# EasyEDA Pro project MAR.eprj

# Schematic Schematic1
Board Name: Board1; Create Date: 2025-08-24; Page Name: P1; Project Name: MAR; Schematic Name: Schematic1; Update Date: 2025-08-26; Company: EasyEDA.com; Page Size: A4; Version: V1.0
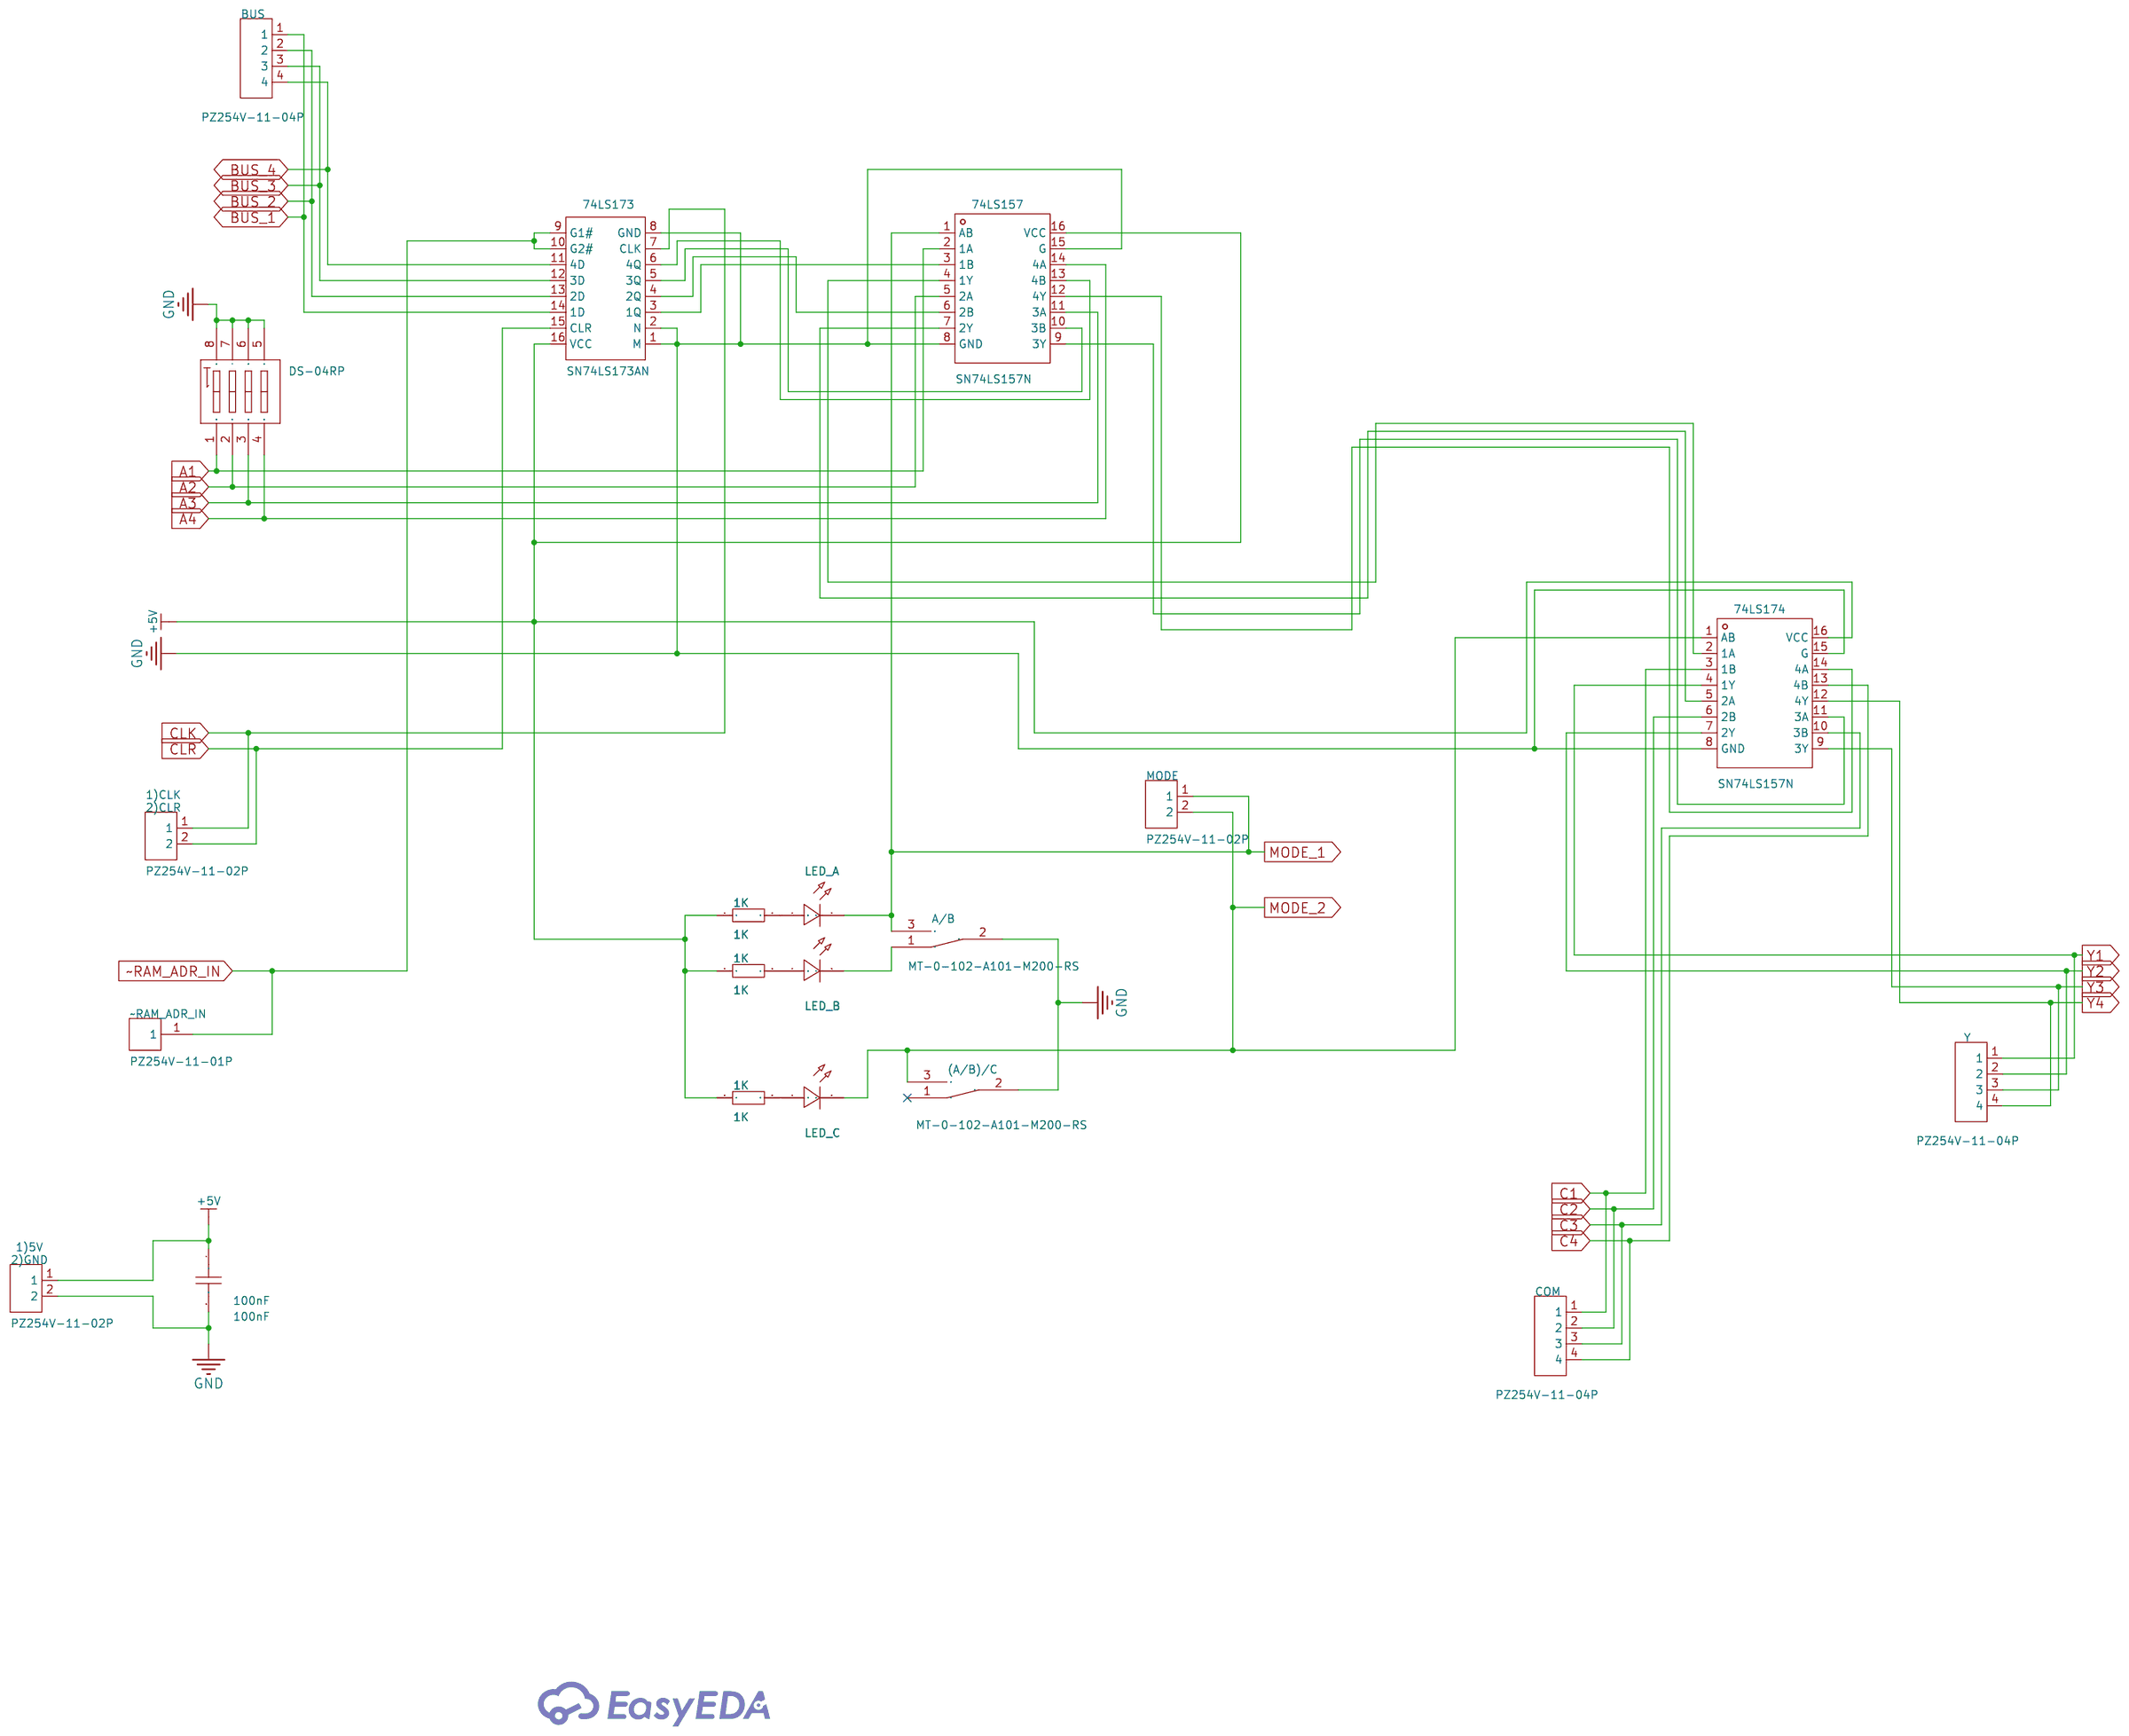
[diagram p0: schematic sheet]

## Parts
1)5V
2)GND  PZ254V-11-02P  [HDR-TH_2P-P2.54-V-M]
1)CLK
2)CLR  PZ254V-11-02P  [HDR-TH_2P-P2.54-V-M]
1K  1K  [R_AXIAL-0.4]
1K#2  1K  [R_AXIAL-0.4]
1K#3  1K  [R_AXIAL-0.4]
74LS157  SN74LS157N  [DIP-16_16P-L20.2-W6.6-P2.54-LS7.6-BL]
74LS173  SN74LS173AN  [PDIP-16_L19.3-W6.4-P2.54-LS7.94-BL]
74LS174  SN74LS157N  [DIP-16_16P-L20.2-W6.6-P2.54-LS7.6-BL]
100nF  100nF  [CAP-TH_L8.5-W5.0-P5.00-D1.2]
(A/B)/C  MT-0-102-A101-M200-RS  [SW-TH_MT-0-103-A101-M200-RS]
A/B  MT-0-102-A101-M200-RS  [SW-TH_MT-0-103-A101-M200-RS]
BUS  PZ254V-11-04P  [HDR-TH_4P-P2.54-V-M]
COM  PZ254V-11-04P  [HDR-TH_4P-P2.54-V-M]
DIP  DS-04RP  [SW-TH_DS-04XP]
LED_A  -  [LED-TH_BD5.8-P2.54-FD]
LED_B  -  [LED-TH_BD5.8-P2.54-FD]
LED_C  -  [LED-TH_BD5.8-P2.54-FD]
MODE  PZ254V-11-02P  [HDR-TH_2P-P2.54-V-M]
Y  PZ254V-11-04P  [HDR-TH_4P-P2.54-V-M]
~RAM_ADR_IN  PZ254V-11-01P  [HDR-TH_1P-P2.54-V-M]

## Library data of the parts
1)5V
2)GND 1)CLK
2)CLR MODE = PZ254V-11-02P: LCSC Part Name: 1x2P 间距:2.54mm 方针 直插; Supplier Part: C492401; Manufacturer: XFCN(兴飞); Supplier Footprint: 插件,P=2.54mm; JLCPCB Part Class: Extended Part; Datasheet: https://item.szlcsc.com/datasheet/PZ254V-11-02P/502957.html; Supplier: LCSC; Pin Structure: 1x2P; Pitch: 2.54mm; Circluar Pins/Square Pins: Pin Header; Mounting Type: Through Hole; Number of Rows: 1; Number of Pins: 2P; Length of Mating Pin: 6mm; Insulation Height: 2.5mm; Length of End Connection Pin: 3mm; Contact Material: Brass; Operating Temperature: -40℃~+105℃; Color: Black
1K 1K#2 1K#3 = Res_AXIAL-1/4W: Supplier Footprint: Through
74LS157 74LS174 = SN74LS157N: Type:Multiplexers Voltage Supply Source:Single supply Supply Voltage:4.75V~5.25V Supply Voltage:4.75V~5.25V Sink Current:8mA Source Current:400uA Operating temperature:0℃~+70℃ Operating temperature:0℃~+70℃; Supplier Part: C139317; Manufacturer: TI(德州仪器); Supplier Footprint: DIP-16; JLCPCB Part Class: Extended Part; Datasheet: https://www.ti.com/cn/lit/gpn/sn74ls157; Supplier: LCSC; Type: Multiplexers; Voltage Supply Source: Single supply; Supply Voltage: 4.75V~5.25V; Sink Current: 8mA; Source Current: 400uA; Operating temperature: 0℃~+70℃
74LS173 = SN74LS173AN: Type:D-Type Trigger Type:Rising Edge Voltage - Supply:4.75V~5.25V Voltage - Supply:4.75V~5.25V Clock Frequency:50MHz Function:Reset Number of Elements:1 Number of Bits per Element:4 Output Type:- Propagation Delay:30ns@5V,45pF Series:74LS Series Current -; Supplier Part: C1550125; Manufacturer: TI(德州仪器); Supplier Footprint: PDIP-16; JLCPCB Part Class: Extended Part; Datasheet: https://www.ti.com/cn/lit/gpn/sn74ls173a; Supplier: LCSC; Type: D-Type; Trigger Type: Rising Edge; Voltage - Supply: 4.75V~5.25V; Clock Frequency: 50MHz; Function: Reset; Number of Elements: 1; Number of Bits per Element: 4; Propagation Delay: 30ns@5V,45pF; Series: 74LS Series; Current - Output Low(IOL): 24mA; Current - Output High(IOH): 2.6mA; Quiescent Current: 24mA; Operating Temperature: 0℃~+70℃
100nF = CT4-0805B104K500F3: Capacitance:100nF Tolerance:±10% Tolerance:±10% Voltage Rated: Temperature Coefficient:; LCSC Part Name: 100nF ±10% 50V C3型（直脚）; Supplier Part: C84772; Manufacturer: FH(风华); Supplier Footprint: 插件,P=5.08mm; JLCPCB Part Class: Extended Part; Datasheet: https://atta.szlcsc.com/upload/public/pdf/source/20190402/C385200_059806A6312B28FF1421A2413EB641E1.pdf; Supplier: LCSC; Tolerance: ±10%
(A/B)/C A/B = MT-0-102-A101-M200-RS: Circuit:Single Pole Double Throw (SPDT) Switch Length:13mm Switch Width:8mm Switch Height:28.6mm Mechanical Life:- Contact Current:5A Voltage Rating (AC):125V Actuator Type:Cylinder knob Pin Style:Solder Mounting Style:Direct Insert Operating Temperature:; LCSC Part Name: 小型钮子三脚二档 五件套; Supplier Part: C1788492; Manufacturer: YUEN FUNG(源丰); Supplier Footprint: 插件; JLCPCB Part Class: Extended Part; Datasheet: https://atta.szlcsc.com/upload/public/pdf/source/20230720/8E5C36EFDF374AE4FF4AC09DB233CE0E.pdf; Supplier: LCSC; Circuit: Single Pole Double Throw (SPDT); Switch Length: 13mm; Switch Width: 8mm; Switch Height: 28.6mm; Contact Current: 5A; Voltage Rating (AC): 125V; Actuator Type: Cylinder knob; Pin Style: Solder; Mounting Style: Direct Insert; Operating Temperature: -25℃~+85℃
BUS COM Y = PZ254V-11-04P_C492403: LCSC Part Name: 1x4P 间距:2.54mm 方针 直插; Supplier Part: C492403; Manufacturer: XFCN(兴飞); Supplier Footprint: 插件,P=2.54mm; JLCPCB Part Class: Extended Part; Datasheet: https://atta.szlcsc.com/upload/public/pdf/source/20200309/C492403_F9F19131791D08044AD4F84F8E751A34.pdf; Supplier: LCSC; Pin Structure: 1x4P; Pitch: 2.54mm; Circluar Pins/Square Pins: Policy; Mounting Type: Straight; Number of Rows: Single Row; Number of Pins: 4P; Length of Mating Pin: 6mm; Insulation Height: 2.5mm; Length of End Connection Pin: 3mm; Contact Material: Brass; Operating Temperature: -40℃~+105℃; Color: Black
DIP = DS-04RP_C92645: LCSC Part Name: 间距2.54mm 平拨,凸起式 4位拨码开关; Supplier Part: C92645; Manufacturer: 韩国韩荣; Supplier Footprint: 插件; JLCPCB Part Class: Extended Part; Datasheet: https://atta.szlcsc.com/upload/public/pdf/source/20210810/ECF2F28B1CE673E7F9581E27682BDB10.pdf; Supplier: LCSC; Type: 平拨,凸起式; Circuit: SPST; Number of Positions: 4Bit; Lead Pitch: 2.54mm; Current Rating: 25mA; Voltage Rating: 24V; Operating Temperature: -20℃~+70℃; Operating Life: 3千次; Color: Red
LED_A LED_B LED_C = LED_TH-R_5mm: Supplier Footprint: Through
~RAM_ADR_IN = PZ254V-11-01P: LCSC Part Name: 1x1P 间距:2.54mm 方针 直插; Supplier Part: C492400; Manufacturer: XFCN(兴飞); Supplier Footprint: 插件,P=2.54mm; JLCPCB Part Class: Extended Part; Datasheet: https://item.szlcsc.com/datasheet/PZ254V-11-01P/502956.html; Supplier: LCSC; Pin Structure: 1x1P; Pitch: 2.54mm; Circluar Pins/Square Pins: Pin Header; Mounting Type: Through Hole; Number of Rows: 1; Number of Pins: 1P; Length of Mating Pin: 6mm; Insulation Height: 2.5mm; Length of End Connection Pin: 3mm; Contact Material: Brass; Operating Temperature: -40℃~+105℃; Color: Black

## Nets
+5V: 1)5V
2)GND.1 1K.1 1K#2.1 1K#3.1 74LS157.16(VCC) 74LS173.16(VCC) 74LS174.16(VCC) 100nF.1
GND: 1)5V
2)GND.2 74LS157.8(GND) 74LS157.15(G) 74LS173.1(M) 74LS173.2(N) 74LS173.8(GND) 74LS174.8(GND) 74LS174.15(G) 100nF.2 (A/B)/C.2 A/B.2 DIP.5 DIP.6 DIP.7 DIP.8
A1: 74LS157.2(1A) DIP.1(A1)
A2: 74LS157.5(2A) DIP.2(A2)
A3: 74LS157.11(3A) DIP.3(A3)
A4: 74LS157.14(4A) DIP.4(A4)
BUS_1: 74LS173.14(1D) BUS.1
BUS_2: 74LS173.13(2D) BUS.2
BUS_3: 74LS173.12(3D) BUS.3
BUS_4: 74LS173.11(4D) BUS.4
C1: 74LS174.3(1B) COM.1
C2: 74LS174.6(2B) COM.2
C3: 74LS174.10(3B) COM.3
C4: 74LS174.13(4B) COM.4
CLK: 1)CLK
2)CLR.1 74LS173.7(CLK)
CLR: 1)CLK
2)CLR.2 74LS173.15(CLR)
MODE_1: 74LS157.1(AB) A/B.3 LED_A.2(A) MODE.1
MODE_2: 74LS174.1(AB) (A/B)/C.3 LED_C.2(A) MODE.2
Y1: 74LS174.4(1Y) Y.1
Y2: 74LS174.7(2Y) Y.2
Y3: 74LS174.9(3Y) Y.3
Y4: 74LS174.12(4Y) Y.4
~RAM_ADR_IN: 74LS173.9(G1#) 74LS173.10(G2#) ~RAM_ADR_IN.1
$1N1780: 74LS157.10(3B) 74LS173.5(3Q)
$1N1781: 74LS157.6(2B) 74LS173.4(2Q)
$1N1782: 74LS157.3(1B) 74LS173.3(1Q)
$1N1783: 74LS157.13(4B) 74LS173.6(4Q)
$1N1788: 74LS157.4(1Y) 74LS174.2(1A)
$1N1796: 74LS157.7(2Y) 74LS174.5(2A)
$1N1804: 74LS157.9(3Y) 74LS174.11(3A)
$1N1814: 74LS157.12(4Y) 74LS174.14(4A)
$1N1887: A/B.1 LED_B.2(A)
Net-(1K#2-2): 1K#2.2 LED_B.1(C)
Net-(1K#3-2): 1K#3.2 LED_C.1(C)
Net-(1K-2): 1K.2 LED_A.1(C)

Not connected (* = marked no-connect by the designer): (A/B)/C 1*

# Board PCB1
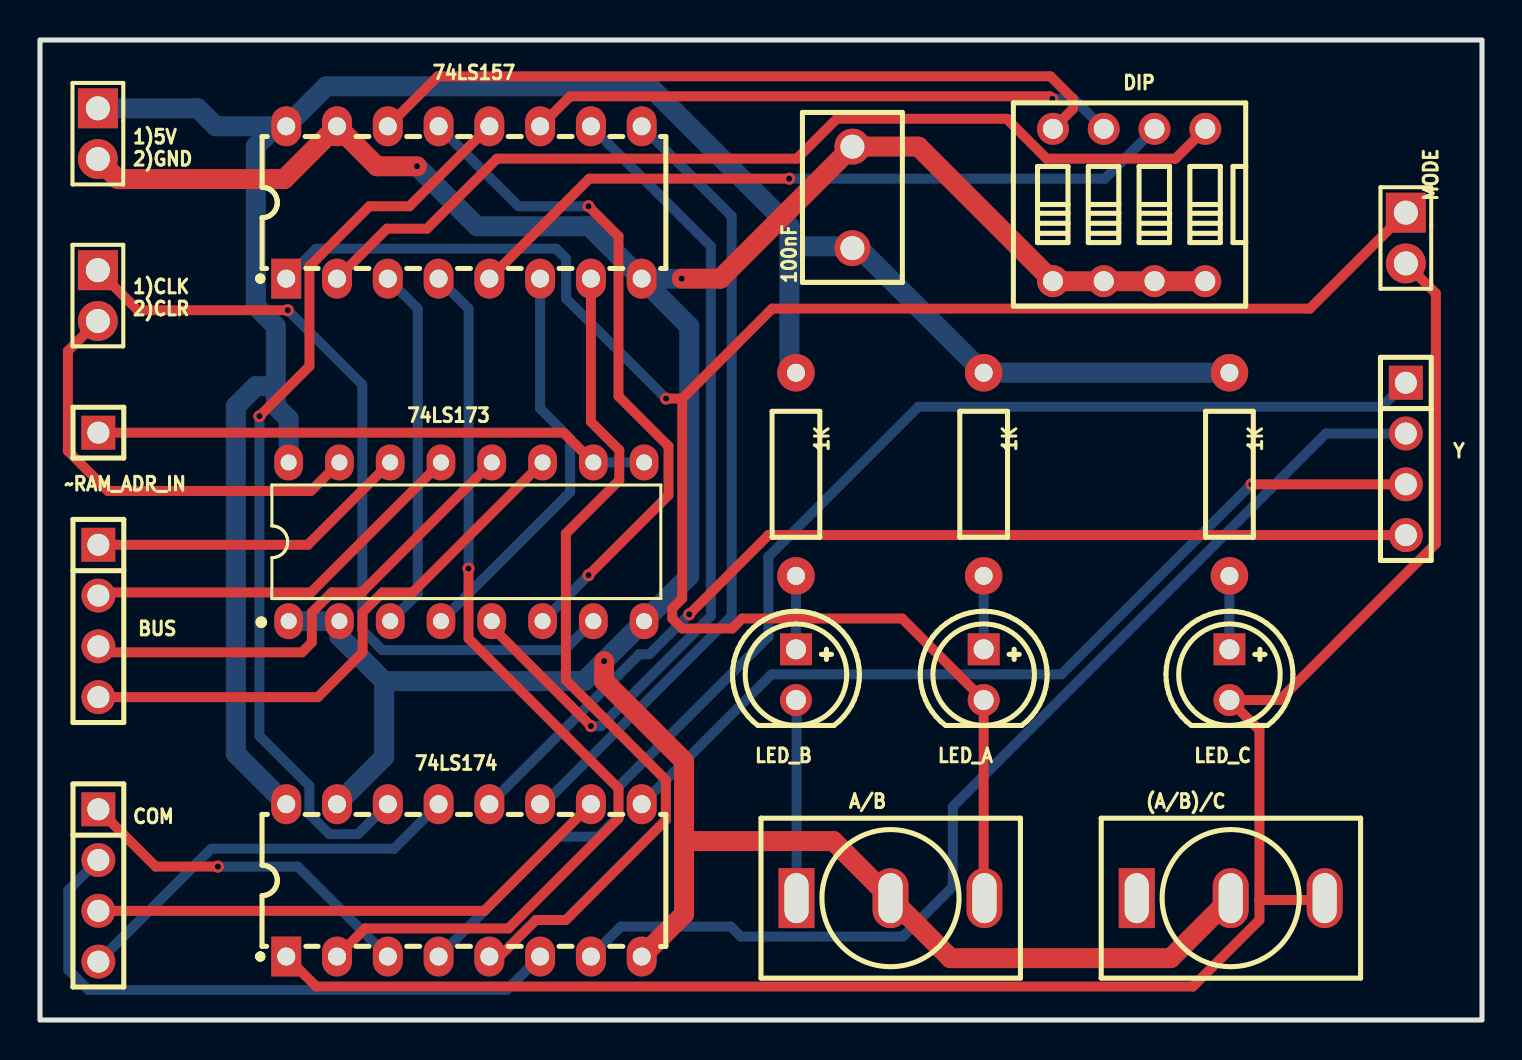
[diagram p1: board, top side]
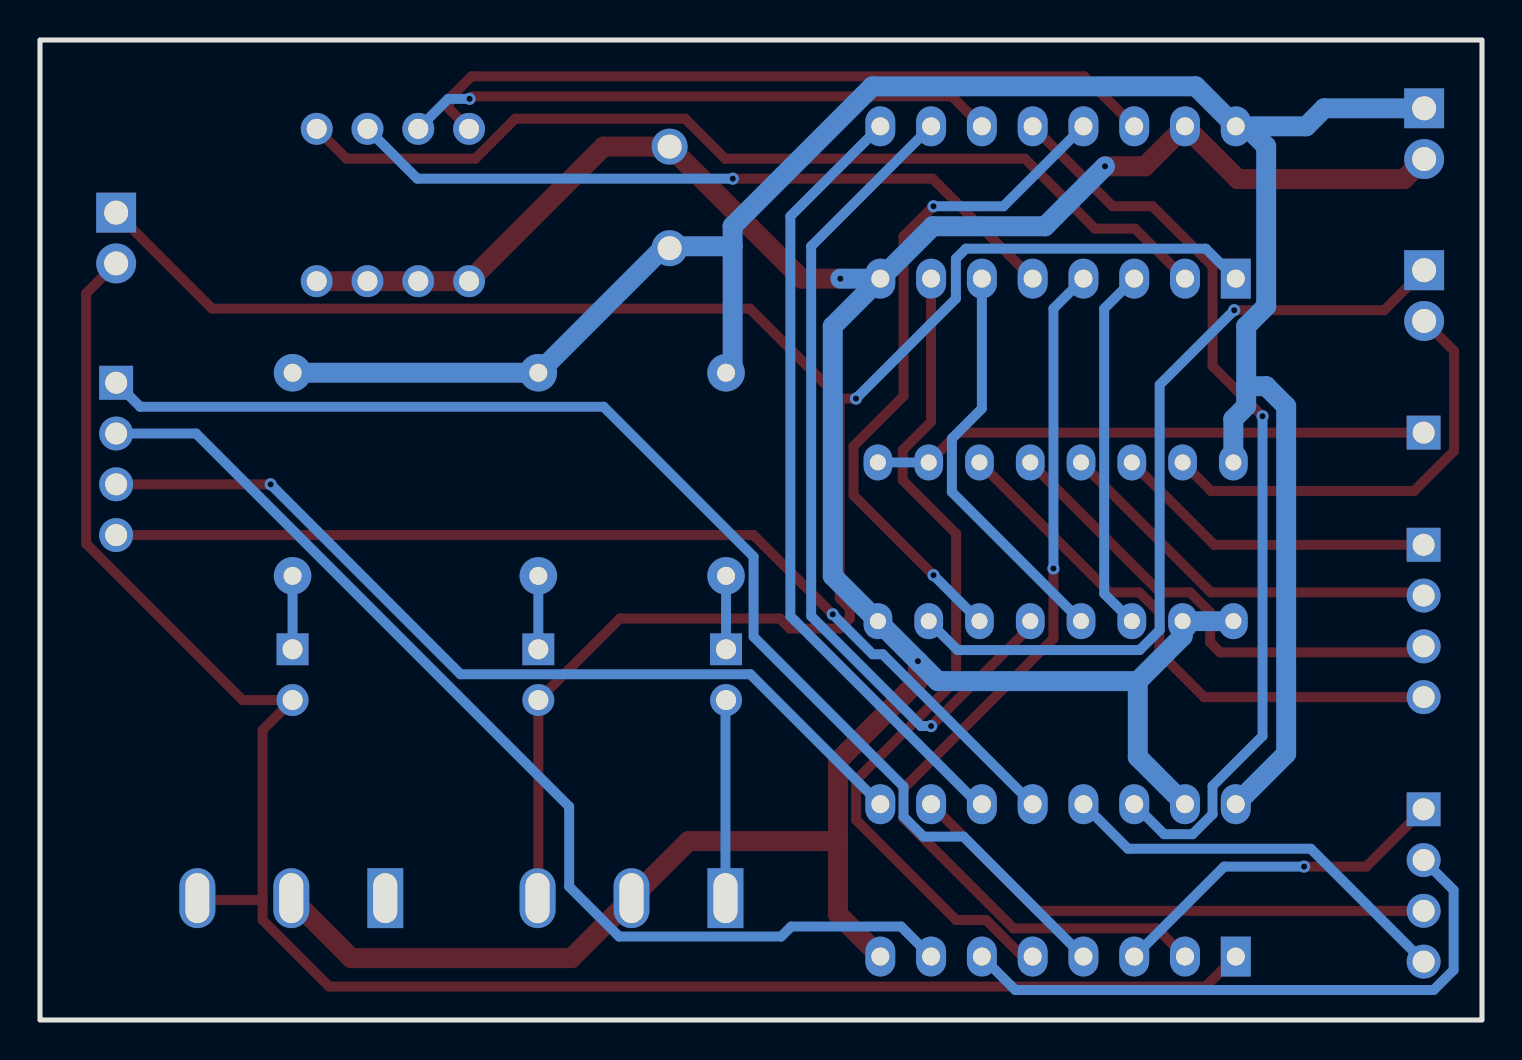
[diagram p2: board, bottom side, seen from below]

Outline 72.14 x 49.02 mm; copper layers: Top Layer, Bottom Layer. Coordinates in mm from the lower left corner of the outline.
Outline path: rectangle 0,49.02 72.14,0
Stack: Top Layer 0.035mm / Dielectric1 1.51mm FR4 er 4.5 / Bottom Layer 0.035mm

## Design rules (mm)
template: Custom Config
spacing copperThickness1oz (default): track to track 0.102, other pairs 0.152 to 0.3
spacing copperThickness2oz: track to track 0.203, other pairs 0.152 to 0.3
track width copperThickness1oz (default): min 0.127, default 0.5, max 2.54
track width copperThickness2oz: min 0.203, default 1, max 2.54
differential pair differentialPair (default): width min 0.127, default 0.254, max 2.54; gap min 0.152, default 0.152
via viaSize (default): diameter min 0.5, default 0.61, max 10; hole min 0.3, default 0.305, max 6.3
net +5V uses copperThickness2oz
net GND uses copperThickness2oz

## Placement (name value [footprint] x y rotation side)
1)5V
2)GND  PZ254V-11-02P  [HDR-TH_2P-P2.54-V-M]  2.9 44.34 270 top
1)CLK
2)CLR  PZ254V-11-02P  [HDR-TH_2P-P2.54-V-M]  2.9 36.24 270 top
1K  1K  [R_AXIAL-0.4]  47.21 27.3 270 top
1K#2  1K  [R_AXIAL-0.4]  37.82 27.3 270 top
1K#3  1K  [R_AXIAL-0.4]  59.5 27.3 270 top
74LS157  SN74LS157N  [DIP-16_16P-L20.2-W6.6-P2.54-LS7.6-BL]  21.21 40.89 0 top
74LS173  SN74LS173AN  [PDIP-16_L19.3-W6.4-P2.54-LS7.94-BL]  21.33 23.92 0 top
74LS174  SN74LS157N  [DIP-16_16P-L20.2-W6.6-P2.54-LS7.6-BL]  21.21 6.98 0 top
100nF  100nF  [CAP-TH_L8.5-W5.0-P5.00-D1.2]  40.64 41.15 90 top
(A/B)/C  MT-0-102-A101-M200-RS  [SW-TH_MT-0-103-A101-M200-RS]  59.56 6.1 0 top
A/B  MT-0-102-A101-M200-RS  [SW-TH_MT-0-103-A101-M200-RS]  42.54 6.1 0 top
BUS  PZ254V-11-04P  [HDR-TH_4P-P2.54-V-M]  2.92 19.96 270 top
COM  PZ254V-11-04P  [HDR-TH_4P-P2.54-V-M]  2.92 6.73 270 top
DIP  DS-04RP  [SW-TH_DS-04XP]  54.48 40.77 180 top
LED_A  -  [LED-TH_BD5.8-P2.54-FD]  47.21 17.27 270 top
LED_B  -  [LED-TH_BD5.8-P2.54-FD]  37.82 17.27 270 top
LED_C  -  [LED-TH_BD5.8-P2.54-FD]  59.5 17.27 270 top
MODE  PZ254V-11-02P  [HDR-TH_2P-P2.54-V-M]  68.33 39.12 270 top
Y  PZ254V-11-04P  [HDR-TH_4P-P2.54-V-M]  68.33 28.07 270 top
~RAM_ADR_IN  PZ254V-11-01P  [HDR-TH_1P-P2.54-V-M]  2.92 29.38 0 top

## Footprints (pads in the part's own frame, mm; a bottom-side part is the same pattern mirrored in y, then rotated)
CAP-TH_L8.5-W5.0-P5.00-D1.2
  round 1.8 hole 1.2: 1(-2.54,0) 2(2.54,0)
DIP-16_16P-L20.2-W6.6-P2.54-LS7.6-BL
  rect 1.5x2 hole 0.9: 1(-8.89,-3.81)
  oval 1.5x2 hole 0.9: 2(-6.35,-3.81) 3(-3.81,-3.81) 4(-1.27,-3.81) 5(1.27,-3.81) 6(3.81,-3.81) 7(6.35,-3.81) 8(8.89,-3.81) 9(8.89,3.81) 10(6.35,3.81) 11(3.81,3.81) 12(1.27,3.81) 13(-1.27,3.81) 14(-3.81,3.81) 15(-6.35,3.81) 16(-8.89,3.81)
HDR-TH_1P-P2.54-V-M
  rect 1.7x1.7 hole 1.1: 1(0,0)
HDR-TH_2P-P2.54-V-M
  rect 2x2 hole 1.2: 1(-1.27,0)
  round 2 hole 1.2: 2(1.27,0)
HDR-TH_4P-P2.54-V-M
  rect 1.7x1.7 hole 1.1: 1(-3.81,0)
  round 1.7 hole 1.1: 2(-1.27,0) 3(1.27,0) 4(3.81,0)
LED-TH_BD5.8-P2.54-FD
  rect 1.6x1.6 hole 1: 1(-1.27,0)
  round 1.6 hole 1: 2(1.27,0)
PDIP-16_L19.3-W6.4-P2.54-LS7.94-BL
  oval 1.44x1.8 hole 0.8: 1(-8.89,-3.97) 2(-6.35,-3.97) 3(-3.81,-3.97) 4(-1.27,-3.97) 5(1.27,-3.97) 6(3.81,-3.97) 7(6.35,-3.97) 8(8.89,-3.97) 9(8.89,3.97) 10(6.35,3.97) 11(3.81,3.97) 12(1.27,3.97) 13(-1.27,3.97) 14(-3.81,3.97) 15(-6.35,3.97) 16(-8.89,3.97)
R_AXIAL-0.4
  round 1.879 hole 0.899: 1(-5.08,0) 2(5.08,0)
SW-TH_DS-04XP
  round 1.6 hole 1: 1(-3.81,-3.81) 2(-1.27,-3.81) 3(1.27,-3.81) 4(3.81,-3.81) 5(3.81,3.81) 6(1.27,3.81) 7(-1.27,3.81) 8(-3.81,3.81)
SW-TH_MT-0-103-A101-M200-RS
  rect 1.8x3 hole 1.2x2.5: 1(-4.7,0)
  oval 1.8x3 hole 1.2x2.5: 2(0,0) 3(4.7,0)

## Nets
As in the schematic, except:
$1N1875: 1K.2 LED_A.1
$1N1876: 1K#2.2 LED_B.1
$1N1885: 1K#3.2 LED_C.1

Pads without a net: (A/B)/C 1

## Via types
v1: diameter 0.61, hole 0.305, Top Layer to Bottom Layer, 15 vias

## Routing (per net, layer and track width the routed paths; a pad name or vN(x,y) marks a point on that pad's centre or on a via; arc(x,y) is an arc through that point)
+5V: length 112.1
  Bottom Layer w1: 11.8,44.7 8.8,44.7 7.9,45.61 1)5V
2)GND.1 ; 11.8,44.7 74LS157.16 14.32,46.7 30.49,46.7 37.49,39.7 37.49,38.7 ; 11.8,44.7 10.8,43.7 10.8,35.7 11.8,34.7 11.8,31.7 ; 37.49,38.7 40.54,38.7 100nF.1 40.97,38.61 1K.1 1K#3.1 ; 37.49,38.7 37.49,32.7 1K#2.1 ; 11.8,31.7 11.8,30.7 12.44,30.06 74LS173.16 ; 11.8,31.7 10.8,31.7 9.8,30.7 9.8,13.32 74LS174.16
GND: length 160.8
  Top Layer w1: 1)5V
2)GND.2 3.9,42.07 12.22,42.07 74LS157.15 16.86,42.7 v1(18.86,42.7) ; 32.22,8.95 32.22,5.3 74LS174.8 ; 32.22,8.95 39.69,8.95 A/B.2 45.54,3.1 56.56,3.1 (A/B)/C.2 ; 32.22,8.95 32.22,12.95 28.22,16.95 v1(28.22,17.95) ; v1(32.1,37.08) 34.04,37.08 40.64,43.69 43.94,43.69 DIP.5 DIP.6 DIP.7 DIP.8
  Bottom Layer w1: 74LS157.8 27.48,39.7 21.86,39.7 v1(18.86,42.7) ; 74LS157.8 v1(32.1,37.08) ; 74LS157.8 32.48,34.7 32.48,22.21 74LS173.8 v1(28.22,17.95) 27.22,16.95 17.22,16.95 ; 74LS173.1 74LS173.2 14.98,19.19 17.22,16.95 ; 17.22,16.95 17.22,13.16 74LS174.15
A1: length 48.2
  Top Layer w0.5: 74LS157.2 17.36,39.58 19.36,39.58 22.86,43.08 37.86,43.08 39.86,45.08 48.36,45.08 50.36,43.08 56.8,43.08 DIP.1
A2: length 36.4
  Top Layer w0.5: v1(37.48,42.08) 27.48,42.08 74LS157.5
  Bottom Layer w0.5: v1(37.48,42.08) 53.26,42.08 DIP.2
A3: length 29.5
  Top Layer w0.5: 74LS157.11 26.52,46.2 50.52,46.2 v1(50.65,46.08)
  Bottom Layer w0.5: v1(50.65,46.08) 51.71,46.08 DIP.3
A4: length 37.7
  Top Layer w0.5: DIP.4 51.67,45.58 51.67,46.08 50.55,47.2 19.9,47.2 74LS157.14
BUS_1: length 16.3
  Top Layer w0.5: BUS.1 13.4,23.77 74LS173.14
BUS_2: length 19.9
  Top Layer w0.5: 74LS173.13 13.56,21.39 3.08,21.39 BUS.2
BUS_3: length 24.6
  Top Layer w0.5: 74LS173.12 16.1,21.39 14.6,21.39 13.6,20.39 13.6,18.89 13.1,18.39 3.22,18.39 BUS.3
BUS_4: length 28.3
  Top Layer w0.5: BUS.4 13.9,16.15 16.14,18.39 16.14,20.39 17.14,21.39 18.64,21.39 74LS173.11
C1: length 17.5
  Top Layer w0.5: v1(8.9,7.68) 5.79,7.68 COM.1
  Bottom Layer w0.5: 74LS174.3 12.9,7.68 v1(8.9,7.68)
C2: length 30.8
  Bottom Layer w0.5: COM.2 1.42,6.5 1.42,2.5 2.42,1.5 23.34,1.5 74LS174.6
C3: length 26.8
  Top Layer w0.5: COM.3 22.22,5.46 74LS174.10
C4: length 20.3
  Bottom Layer w0.5: COM.4 8.57,8.57 17.71,8.57 74LS174.13
CLK: length 40.4
  Top Layer w0.5: 1)CLK
2)CLR.1 4.9,35.51 v1(12.4,35.51)
  Bottom Layer w0.5: 74LS173.7 26.23,18.51 17.12,18.51 16.12,19.51 16.12,31.78 v1(12.4,35.51)
CLR: length 22.1
  Top Layer w0.5: 1)CLK
2)CLR.2 1.4,33.47 1.4,28.47 3.4,26.47 13.55,26.47 74LS173.15
MODE_1: length 103.6
  Top Layer w0.5: 32.13,31.08 36.63,35.58 63.52,35.58 68.33,40.39 ; 32.13,31.08 v1(31.32,31.08) ; 32.13,31.08 32.13,21.08 31.63,20.58 31.63,20.08 32.13,19.58 34.63,19.58 35.13,20.08 43.13,20.08 LED_A.2 47.21,6.13 A/B.3
  Bottom Layer w0.5: 74LS157.1 13.82,38.58 25.82,38.58 26.32,38.08 26.32,36.08 v1(31.32,31.08)
MODE_2: length 93.8
  Top Layer w0.5: 61,6 64.17,6 (A/B)/C.3 ; 61,6 61,5 57.67,1.68 13.82,1.68 74LS174.1 ; 61,6 61,14.5 LED_C.2 62,16 69.83,23.83 69.83,36.35 MODE.2
Y1: length 63.5
  Bottom Layer w0.5: 74LS174.4 25.94,9.18 27.94,9.18 28.94,10.18 28.94,11.68 36.44,19.18 36.44,23.18 43.94,30.68 67.12,30.68 Y.1
Y2: length 54.4
  Bottom Layer w0.5: 74LS174.7 29.06,4.68 34.56,4.68 35.06,4.18 43.16,4.18 45.66,6.68 45.66,10.68 64.33,29.34 Y.2
Y3: length 44.9
  Top Layer w0.5: v1(60.6,26.8) 68.32,26.8
  Bottom Layer w0.5: 74LS174.9 36.6,17.3 51.1,17.3 v1(60.6,26.8)
Y4: length 51.4
  Top Layer w0.5: Y.4 36.44,24.26 v1(32.48,20.3)
  Bottom Layer w0.5: v1(32.48,20.3) 30.48,18.3 29.98,18.3 74LS174.12
~RAM_ADR_IN: length 27.9
  Top Layer w0.5: ~RAM_ADR_IN.1 26.19,29.38 74LS173.10
  Bottom Layer w0.5: 74LS173.10 74LS173.9
$1N1780: length 42.6
  Top Layer w0.5: 74LS173.5 22.6,19.66 v1(27.56,14.7)
  Bottom Layer w0.5: 74LS157.10 33.56,38.7 33.56,20.2 28.06,14.7 v1(27.56,14.7)
$1N1781: length 20.4
  Bottom Layer w0.5: 74LS173.4 26.52,26.41 26.52,29.08 25.02,30.58 74LS157.6
$1N1782: length 18.3
  Bottom Layer w0.5: 74LS173.3 18.9,21.33 18.9,35.58 74LS157.3
$1N1783: length 34.2
  Top Layer w0.5: v1(27.44,40.7) 28.94,39.2 28.94,31.2 31.44,28.7 31.44,26.25 v1(27.44,22.25)
  Bottom Layer w0.5: 74LS157.13 23.94,40.7 v1(27.44,40.7) ; v1(27.44,22.25) 74LS173.6
$1N1788: length 47.7
  Top Layer w0.5: v1(21.44,22.58) 21.44,19.08 28.94,11.58 28.94,10.08 23.44,4.58 16.27,4.58 74LS174.2
  Bottom Layer w0.5: 74LS157.4 21.44,35.58 v1(21.44,22.58)
$1N1796: length 42.5
  Top Layer w0.5: 74LS174.5 22.98,3.18 24.81,5 26.31,5 31.31,10 31.31,12 26.31,17 26.31,24.33 28.98,27 28.98,28.5 27.56,29.92 74LS157.7
$1N1804: length 39.8
  Bottom Layer w0.5: 74LS174.11 25.19,10.8 34.6,20.2 34.6,40.2 74LS157.9
$1N1814: length 46.3
  Top Layer w0.5: 74LS157.12 18.48,40.7 16.48,40.7 13.48,37.7 13.48,32.7 v1(10.98,30.2)
  Bottom Layer w0.5: 74LS174.14 15.9,9.3 14.48,9.3 13.48,10.3 13.48,11.7 10.98,14.2 v1(10.98,30.2)
$1N1875: length 3.7
  Bottom Layer w0.5: LED_A.1 1K.2
$1N1876: length 3.7
  Bottom Layer w0.5: LED_B.1 1K#2.2
$1N1885: length 3.7
  Bottom Layer w0.5: LED_C.1 1K#3.2
$1N1887: length 9.9
  Bottom Layer w0.5: A/B.1 37.84,15.98 LED_B.2
